# EAGLE schematic ETC_module (EAGLE 7.4.0)
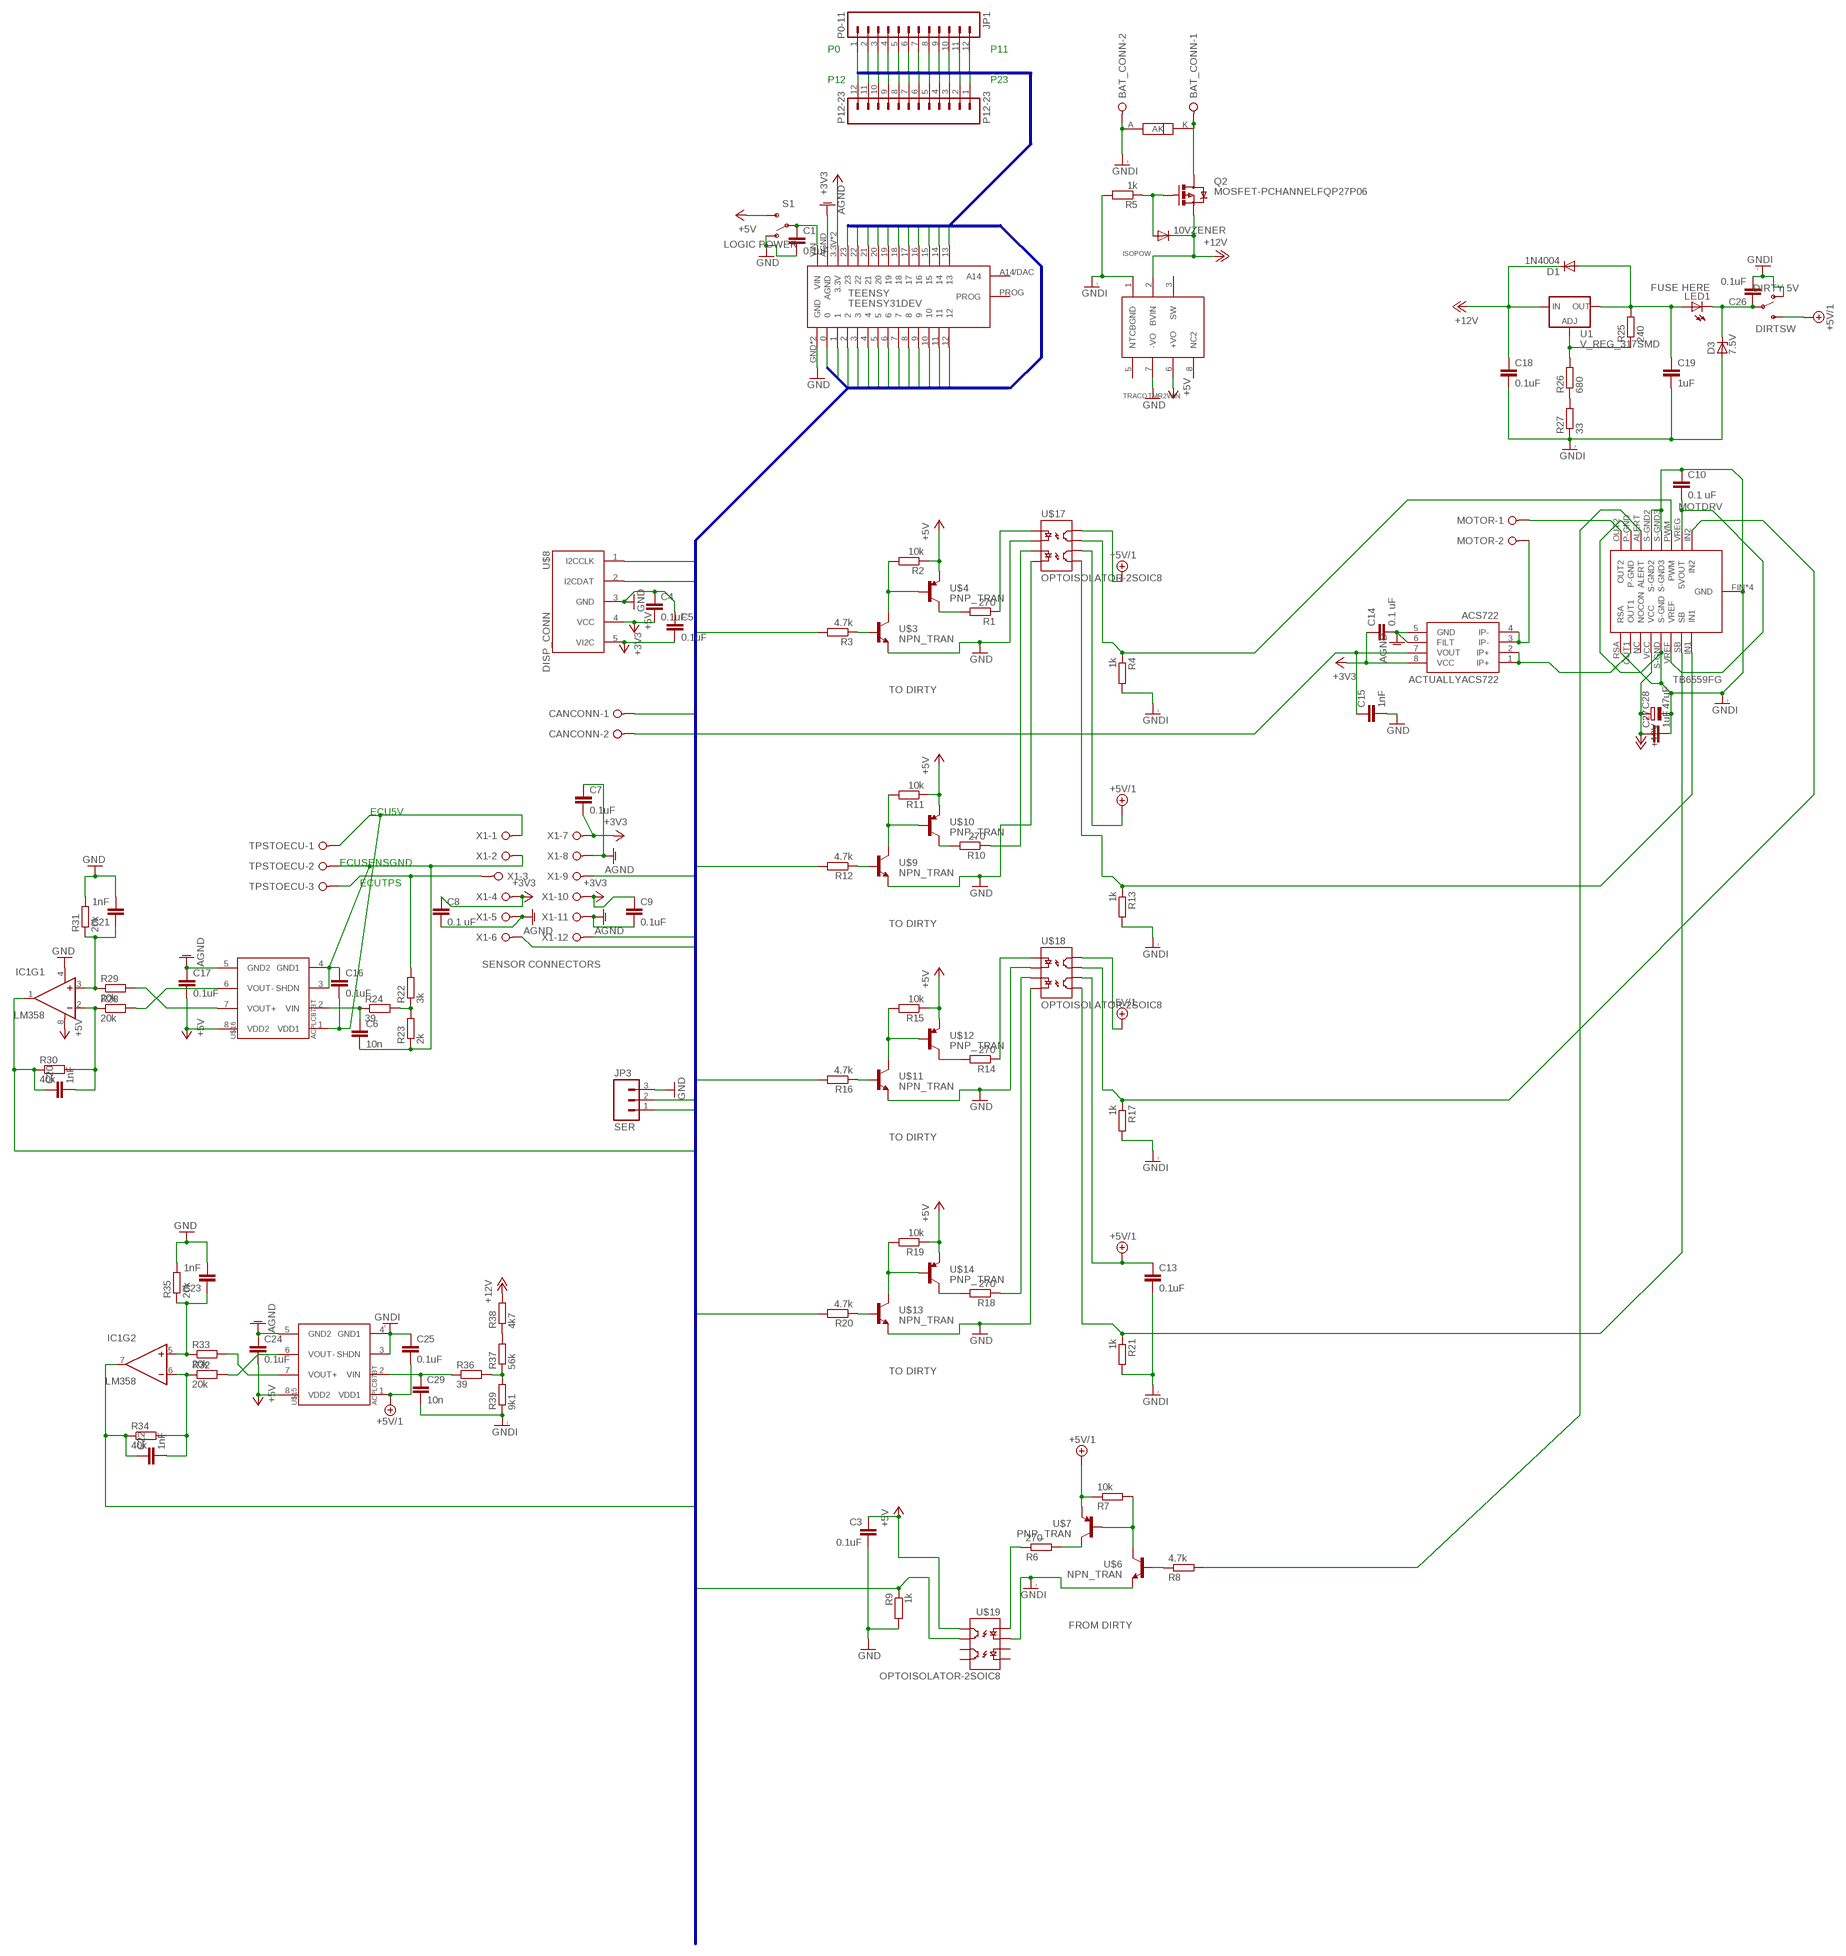
[diagram p0: schematic, sheet 1]

## Parts
10VZENER  DIODE-DO214BA  [DO214BA]
ACTUALLYACS722  ACS722  ACS712  [SO08]
BAT_CONN  W237-02P  [W237-132]
C1  0.1uF  C-EUC1206  [C1206]
C3  0.1uF  C-EUC1206  [C1206]
C4  0.1uF  C-EUC1206  [C1206]
C5  0.1uF  C-EUC1206  [C1206]
C6  10n  C-EUC1206  [C1206]
C7  0.1uF  C-EUC1206  [C1206]
C8  0.1 uF  C-EUC1206  [C1206]
C9  0.1uF  C-EUC1206  [C1206]
C10  0.1 uF  C-EUC1206  [C1206]
C13  0.1uF  C-EUC1206  [C1206]
C14  0.1 uF  C-EUC1206  [C1206]
C15  1nF  C-EUC1206  [C1206]
C16  0.1uF  C-EUC1206  [C1206]
C17  0.1uF  C-EUC1206  [C1206]
C18  0.1uF  C-EUC1206  [C1206]
C19  1uF  C-EUC1206  [C1206]
C20  1nF  C-EUC1206  [C1206]
C21  1nF  C-EUC1206  [C1206]
C22  1nF  C-EUC1206  [C1206]
C23  1nF  C-EUC1206  [C1206]
C24  0.1uF  C-EUC1206  [C1206]
C25  0.1uF  C-EUC1206  [C1206]
C26  0.1uF  C-EUC1206  [C1206]
C27  1uF  C-EUC1206  [C1206]
C28  47uF  CPOL-EUE5-8.5  [E5-8,5]
C29  10n  C-EUC1206  [C1206]
CANCONN  W237-02P  [W237-132]
D1  1N4004  [DO41-10]
D3  7.5V  ZENER-DIODEZD-7.5  [ZDIO-7.5]
DIRTSW  DIRTY 5V  SWITCH-SPDTKIT  [SWITCH-SPDT_KIT]
IC1  LM358  [DIP08]
ISOPOW  TRACOTMR2WIN  [TRACOPOWERDC-DCTRM2WIN]
JP1  P0-11  M12LOCK  [1X12_LOCK]
JP3  SER  M03POLAR_LOCK  [MOLEX-1X3_LOCK]
LED1  FUSE HERE  LED1206  [LED-1206]
MOTDRV  TB6559FG  [HSOP16-P-300-1.00]
MOTOR  W237-02P  [W237-132]
P12-23  P12-23  M12LOCK  [1X12_LOCK]
Q2  MOSFET-PCHANNELFQP27P06  [TO220V]
R1  270  R-EU_R1206  [R1206]
R2  10k  R-EU_R1206  [R1206]
R3  4.7k  R-EU_R1206  [R1206]
R4  1k  R-EU_R1206  [R1206]
R5  1k  R-EU_R1206  [R1206]
R6  270  R-EU_R1206  [R1206]
R7  10k  R-EU_R1206  [R1206]
R8  4.7k  R-EU_R1206  [R1206]
R9  1k  R-EU_R1206  [R1206]
R10  270  R-EU_R1206  [R1206]
R11  10k  R-EU_R1206  [R1206]
R12  4.7k  R-EU_R1206  [R1206]
R13  1k  R-EU_R1206  [R1206]
R14  270  R-EU_R1206  [R1206]
R15  10k  R-EU_R1206  [R1206]
R16  4.7k  R-EU_R1206  [R1206]
R17  1k  R-EU_R1206  [R1206]
R18  270  R-EU_R1206  [R1206]
R19  10k  R-EU_R1206  [R1206]
R20  4.7k  R-EU_R1206  [R1206]
R21  1k  R-EU_R1206  [R1206]
R22  3k  R-EU_M1206  [M1206]
R23  2k  R-EU_M1206  [M1206]
R24  39  R-EU_R1206  [R1206]
R25  240  R-EU_R1206  [R1206]
R26  680  R-EU_R1206  [R1206]
R27  33  R-EU_R1206  [R1206]
R28  20k  R-EU_R1206  [R1206]
R29  20k  R-EU_R1206  [R1206]
R30  40k  R-EU_R1206  [R1206]
R31  20k  R-EU_R1206  [R1206]
R32  20k  R-EU_R1206  [R1206]
R33  20k  R-EU_R1206  [R1206]
R34  40k  R-EU_R1206  [R1206]
R35  20k  R-EU_R1206  [R1206]
R36  39  R-EU_R1206  [R1206]
R37  56k  R-EU_R1206  [R1206]
R38  4k7  R-EU_R1206  [R1206]
R39  9k1  R-EU_R1206  [R1206]
S1  LOGIC POWER  SWITCH-SPDTKIT  [SWITCH-SPDT_KIT]
TEENSY  TEENSY31DEV  [TEENSY31PAC]
TPSTOECU  W237-03P  [W237-133]
U1  V_REG_317SMD  [SOT223]
U$1  LNBTVS  [JEDECDO-214AB]
U$3  NPN_TRAN  [SOT23-3]
U$4  PNP_TRAN  [SOT23-3]
U$6  NPN_TRAN  [SOT23-3]
U$7  PNP_TRAN  [SOT23-3]
U$8  DISP_CONN  [DISP_CONN]
U$9  NPN_TRAN  [SOT23-3]
U$10  PNP_TRAN  [SOT23-3]
U$11  NPN_TRAN  [SOT23-3]
U$12  PNP_TRAN  [SOT23-3]
U$13  NPN_TRAN  [SOT23-3]
U$14  PNP_TRAN  [SOT23-3]
U$15  ACPLC87BT  [SO8STRETCH]
U$16  ACPLC87BT  [SO8STRETCH]
U$17  OPTOISOLATOR-2SOIC8  [SO08-2]
U$18  OPTOISOLATOR-2SOIC8  [SO08-2]
U$19  OPTOISOLATOR-2SOIC8  [SO08-2]
X1  W237-12P  [W237-12P]

## Nets
5VOUT: C10.2 MOTDRV.VREF MOTDRV.VREG(5VOUT)
+3V3: ACTUALLYACS722.8(VCC) C5.2 C7.2 C8.1 C9.1 C14.1 TEENSY.3.3V TEENSY.3.3VV(3.3V) U$8.5(VI2C) X1.4 X1.7 X1.10
+5V/1: C13.1 C25.2 DIRTSW.3(S) R7.1 U$7.2(E) U$15.1(VDD1) U$17.6(CL2) U$17.8(CL1) U$18.6(CL2) U$18.8(CL1)
+5VCLEAN: C3.1 C4.2 C17.2 C24.2 IC1.8(V+) ISOPOW.6(+VO) R2.1 R11.1 R15.1 R19.1 S1.3(S) U$4.2(E) U$8.4(VCC) U$10.2(E) U$12.2(E) U$14.2(E) U$15.8(VDD2) U$16.8(VDD2) U$19.8(CL1) ; supply symbol labelled +5V
+12V: 10VZENER.C C18.1 C27.1 C28.+ D1.C ISOPOW.2(BVIN) MOTDRV.VCC Q2.3(S) R38.2 U1.3(IN)
AGND: ACTUALLYACS722.5(GND) ACTUALLYACS722.6(FILT) C7.1 C8.2 C9.2 C14.2 C17.1 C24.1 TEENSY.AGND U$15.5(GND2) U$16.5(GND2) X1.5 X1.8 X1.11
ECU5V: C16.2 TPSTOECU.1 U$16.1(VDD1) X1.1
ECUSENSGND: C6.2 C16.1 R23.1 TPSTOECU.2 U$16.3(SHDN) U$16.4(GND1) X1.2
ECUTPS: R22.2 TPSTOECU.3 X1.3
GND: C1.2 C3.2 C4.1 C5.1 C15.2 C21.2 C23.2 IC1.4(V-) ISOPOW.7(-VO) JP3.3 R9.2 R31.2 R35.2 S1.1(O) TEENSY.GND TEENSY.GND2(GND) U$3.2(E) U$8.3(GND) U$9.2(E) U$11.2(E) U$13.2(E) U$17.2(C1) U$17.4(C2) U$18.2(C1) U$18.4(C2)
GNDI: BAT_CONN.2 C10.1 C13.2 C18.2 C19.2 C25.1 C26.2 C27.2 C28.- C29.2 D3.A DIRTSW.1(O) ISOPOW.1(BGND) MOTDRV.FIN2(GND) MOTDRV.FIN(GND) MOTDRV.P$4(GND) MOTDRV.P$20(GND) MOTDRV.P-GND MOTDRV.RSA MOTDRV.S-GND MOTDRV.S-GND2 MOTDRV.S-GND3 R4.2 R5.2 R13.2 R17.2 R21.2 R27.1 R39.1 U$1.A U$6.2(E) U$15.3(SHDN) U$15.4(GND1) U$19.2(C1)
N$1: R2.2 U$3.3(C) U$4.1(B)
N$2: C1.1 S1.2(P) TEENSY.VIN
N$3: R1.1 U$17.1(A1)
N$4: R1.2 U$4.3(C)
N$5: R3.1 U$3.1(B)
N$6: R7.2 U$6.3(C) U$7.1(B)
N$7: 10VZENER.A Q2.1(G) R5.1
N$8: MOTDRV.PWM R4.1 U$17.7(EM1)
N$9: R6.1 U$19.1(A1)
N$10: R6.2 U$7.3(C)
N$11: R8.1 U$6.1(B)
N$12: R19.2 U$13.3(C) U$14.1(B)
N$14: R18.1 U$18.3(A2)
N$15: C26.1 D3.C DIRTSW.2(P) LED1.C
N$16: R37.2 R38.1
N$17: C19.1 D1.A LED1.A R25.2 U1.2(OUT)
N$18: R11.2 U$9.3(C) U$10.1(B)
N$19: MOTDRV.OUT2 MOTOR.1
N$20: ACTUALLYACS722.1(IP+) ACTUALLYACS722.2(IP+) MOTDRV.OUT1
N$21: R10.1 U$17.3(A2)
N$22: R10.2 U$10.3(C)
N$23: R12.1 U$9.1(B)
N$25: R15.2 U$11.3(C) U$12.1(B)
N$26: R14.1 U$18.1(A1)
N$27: R14.2 U$12.3(C)
N$28: R16.1 U$11.1(B)
N$29: MOTDRV.IN2 R17.1 U$18.7(EM1)
N$30: R18.2 U$14.3(C)
N$31: R20.1 U$13.1(B)
N$32: MOTDRV.ALERT R8.2
N$33: MOTDRV.SB R21.1 U$18.5(EM2)
N$34: ACTUALLYACS722.3(IP-) ACTUALLYACS722.4(IP-) MOTOR.2
N$35: C6.1 R24.1 U$16.2(VIN)
N$36: R22.1 R23.2 R24.2
N$37: R26.1 R27.2
N$38: R25.1 R26.2 U1.1(ADJ)
N$39: R36.2 R37.1 R39.2
N$40: C23.1 IC1.5(+IN) R33.1 R35.1
N$41: C22.2 IC1.6(-IN) R32.1 R34.2
N$42: R32.2 U$15.6(VOUT-)
N$43: MOTDRV.IN1 R13.1 U$17.5(EM2)
N$44: R29.2 U$16.7(VOUT+)
N$45: C21.1 IC1.3(+IN) R29.1 R31.1
N$46: C20.2 IC1.2(-IN) R28.1 R30.2
N$47: R28.2 U$16.6(VOUT-)
N$48: C29.1 R36.1 U$15.2(VIN)
N$52: R33.2 U$15.7(VOUT+)
N$58: BAT_CONN.1 Q2.2(D) U$1.K
P0: JP1.1 JP3.1 TEENSY.0
P1: JP1.2 JP3.2 TEENSY.1
P2: JP1.3 TEENSY.2
P3: CANCONN.1 JP1.4 TEENSY.3
P4: CANCONN.2 JP1.5 TEENSY.4
P5: JP1.6 R9.1 TEENSY.5 U$19.7(EM1)
P6: JP1.7 R3.2 TEENSY.6
P7: JP1.8 R12.2 TEENSY.7
P8: JP1.9 R16.2 TEENSY.8
P9: JP1.10 R20.2 TEENSY.9
P10: JP1.11 TEENSY.10
P11: JP1.12 TEENSY.11
P12: P12-23.12 TEENSY.12
P13: P12-23.11 TEENSY.13
P14: P12-23.10 TEENSY.14 X1.9
P15: P12-23.9 TEENSY.15 X1.12
P16: C20.1 IC1.1(OUT) P12-23.8 R30.1 TEENSY.16
P17: P12-23.7 TEENSY.17 X1.6
P18: P12-23.6 TEENSY.18 U$8.2(I2CDAT)
P19: P12-23.5 TEENSY.19 U$8.1(I2CCLK)
P20: P12-23.4 TEENSY.20
P21: C22.1 IC1.7(OUT) P12-23.3 R34.1 TEENSY.21
P22: ACTUALLYACS722.7(VOUT) C15.1 P12-23.2 TEENSY.22
P23: P12-23.1 TEENSY.23
Unconnected: ISOPOW.3(SW) ISOPOW.5(NTC) ISOPOW.8(NC2) MOTDRV.NC(NOCON) TEENSY.A14/DAC(A14) TEENSY.PROG U$19.3(A2) U$19.4(C2) U$19.5(EM2) U$19.6(CL2)

## Buses
P[0..23]

## Notes on the sheet
- TO DIRTY
- TO DIRTY
- SENSOR CONNECTORS
- TO DIRTY
- TO DIRTY
- FROM DIRTY

## Library data of the parts
10VZENER = diode:DIODE-: DIODE
ACTUALLYACS722 = SparkFun-AnalogIC:ACS712: Hall-effect-based isolated linear current sensor; PROD_ID: IC-08964
BAT_CONN CANCONN MOTOR = con-wago-508:W237-02P: WAGO SREW CLAMP; OC_FARNELL: unknown; OC_NEWARK: unknown
C1 C3 C13 C26 = resistor:C-EU: CAPACITOR, European symbol
C4-C10 C14-C25 C27 C29 = rcl:C-EU: CAPACITOR, European symbol
C28 = rcl:CPOL-EU: POLARIZED CAPACITOR, European symbol
D1 = diode:1N4004: DIODE general purpose rectifier, 1 A
D3 = diode:ZENER-DIODE: Z-Diode
DIRTSW S1 = SparkFun-Electromechanical:SWITCH-SPDT: SPDT Switch Simple slide switch, Spark Fun Electronics SKU : COM-00102 DPDT SMT slide switch, AYZ0202, SWCH-08179; PROD_ID: SWCH-08261
IC1 = SparkFun-AnalogIC:LM358: Jellybean op-amp; PROD_ID: IC-09172
ISOPOW = custom:TRACOTMR2WIN
JP1 P12-23 = SparkFun-Connectors:M12: Header 12 Standard 12-pin 0.1" header. Use with straight break away headers (SKU : PRT-00116), right angle break away headers (PRT-00553), swiss pins (PRT-00743), machine pins (PRT-00117), and female headers (PRT-00115).
JP3 = SparkFun-Connectors:M03: Header 3 Standard 3-pin 0.1" header. Use with straight break away headers (SKU : PRT-00116), right angle break away headers (PRT-00553), swiss pins (PRT-00743), machine pins (PRT-00117), and female headers (PRT-00115). Molex polarized connector foot print use with SKU : PRT-08232 with associated crimp pins and housings.
LED1 = LilyPad-Wearables:LED: LEDs Standard schematic elements and footprints for 5mm, 3mm, 1206, and 0603 sized LEDs. 5mm - Spark Fun Electronics SKU : Comp-SBL
MOTDRV = custom:TB6559FG: toshiba motor driver
Q2 = SparkFun-DiscreteSemi:MOSFET-PCHANNEL: Generic PMOSFET IRLML2244 - TRANS-11153 (SOT-23 -20V -4.3A) (1.Gate 2.Source 3.Drain) FQP27P06 - COM-10349 <http://www.sparkfun.com/products/10349> (TO-220 -60V -27A) (1.Gate 2.Source 3.Drain)
R1-R4 R6-R21 = resistor:R-EU_: RESISTOR, European symbol
R5 R22-R39 = rcl:R-EU_: RESISTOR, European symbol
TEENSY = custom:TEENSY31DEV: TEENSY 3.1 uC headers
TPSTOECU = con-wago-508:W237-03P: WAGO SREW CLAMP; OC_FARNELL: unknown; OC_NEWARK: unknown
U1 = SparkFun-PowerIC:V_REG_317: Voltage Regulator Standard LM317 adjustable voltage regulator. AOI (Adjust Output Input). Google 'LM317 Calculator' for easy to use app to get the two resistor values needed. 240/720 for 5V output. 240/390 for 3.3V output. Spark Fun Electronics SKU : COM-00527
U$1 = custom:LNBTVS
U$3 U$6 U$9 U$11 U$13 = custom:NPN_TRAN
U$4 U$7 U$10 U$12 U$14 = custom:PNP_TRAN
U$8 = custom:DISP_CONN
U$15 U$16 = custom:ACPLC87BT
U$17-U$19 = SparkFun-DiscreteSemi:OPTOISOLATOR-2: Description: Dual gate opto isolator. Vishay part : ILD213T; PROD_ID: IC-09076
X1 = con-wago-508:W237-12P: WAGO SREW CLAMP; OC_FARNELL: unknown; OC_NEWARK: unknown